# Altium schematic sheet overview.SchDoc
size Letter; SheetNumber: 1; SheetTotal: 8
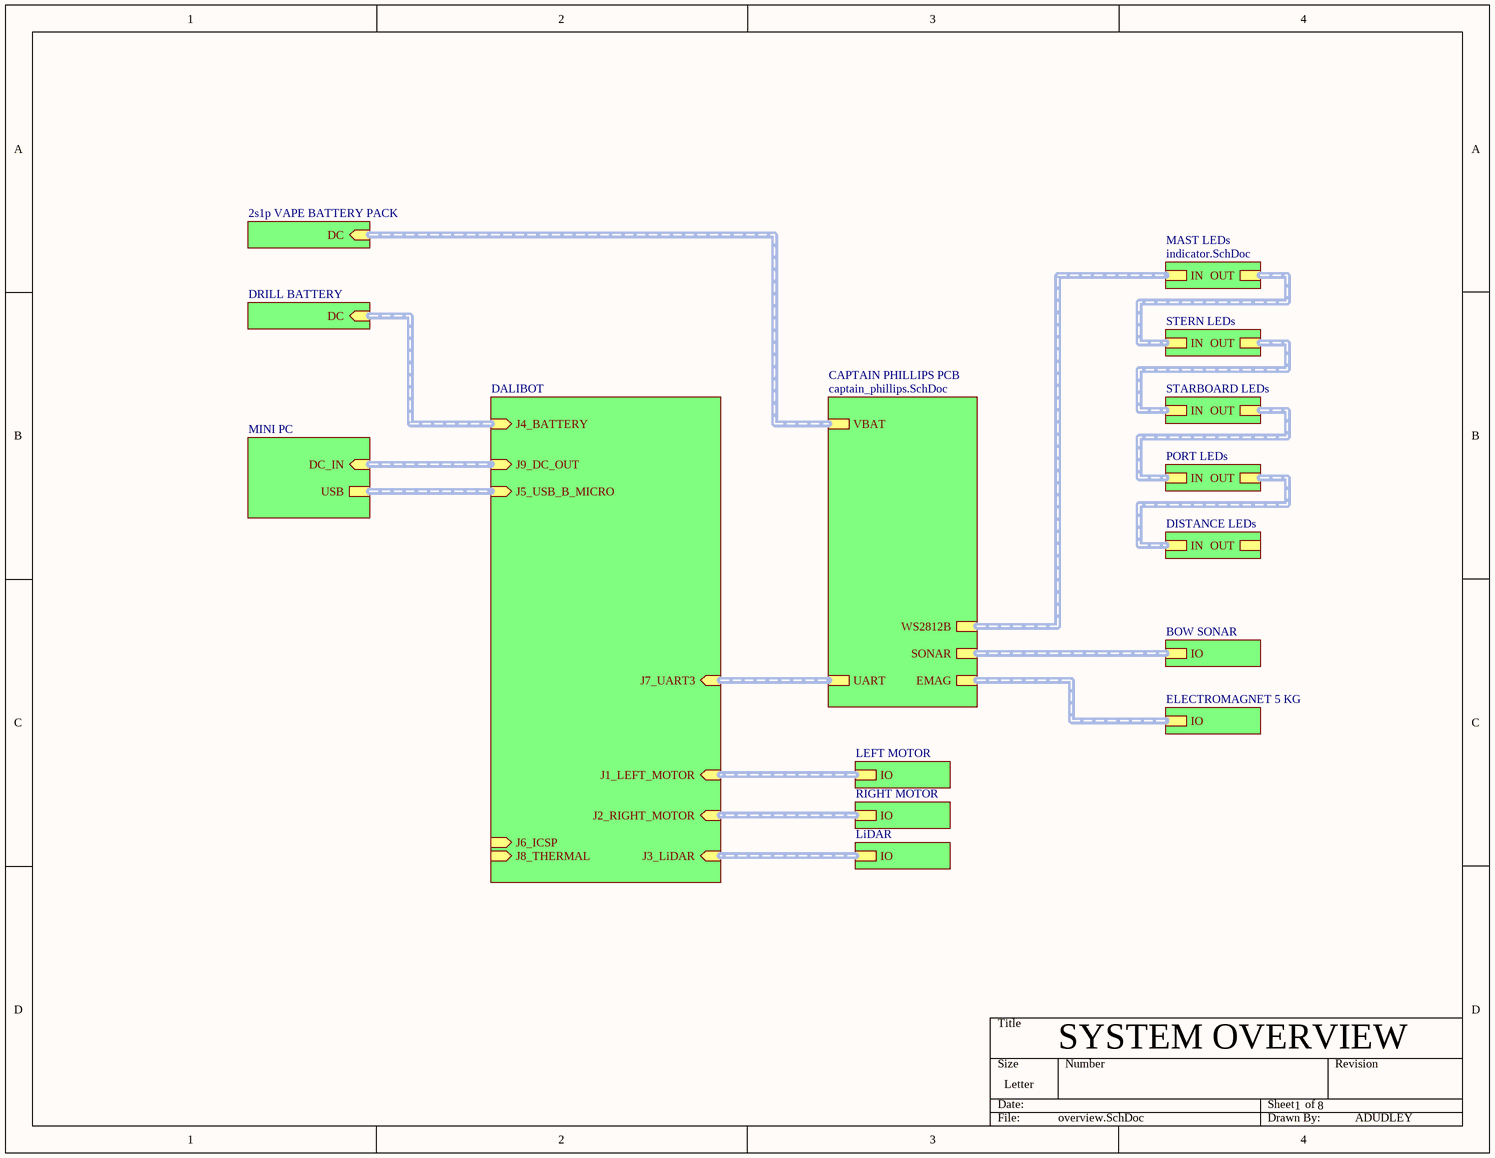
[diagram p0: overview.SchDoc]

## Sub-sheets
2s1p VAPE BATTERY PACK = File Name: DC (in)
BOW SONAR = File Name: IO
CAPTAIN PHILLIPS PCB = captain_phillips.SchDoc: SONAR, UART, WS2812B, EMAG, VBAT
DALIBOT = File Name: J1_LEFT_MOTOR (in), J2_RIGHT_MOTOR (in), J3_LiDAR (in), J4_BATTERY (in), J5_USB_B_MICRO (in), J6_ICSP (in), J7_UART3 (in), J8_THERMAL (in), J9_DC_OUT (in)
DISTANCE LEDs = indicator.SchDoc: OUT, IN
DRILL BATTERY = File Name: DC (in)
ELECTROMAGNET 5 KG = File Name: IO
LEFT MOTOR = File Name: IO
LiDAR = File Name: IO
MAST LEDs = indicator.SchDoc: IN, OUT
MINI PC = File Name: USB, DC_IN (in)
PORT LEDs = indicator.SchDoc: OUT, IN
RIGHT MOTOR = File Name: IO
STARBOARD LEDs = indicator.SchDoc: OUT, IN
STERN LEDs = indicator.SchDoc: OUT, IN

## Buses and harness runs
harness sheet 2s1p VAPE BATTERY PACK/DC = sheet CAPTAIN PHILLIPS PCB/VBAT
harness sheet BOW SONAR/IO = sheet CAPTAIN PHILLIPS PCB/SONAR
harness sheet CAPTAIN PHILLIPS PCB/EMAG = sheet ELECTROMAGNET 5 KG/IO
harness sheet CAPTAIN PHILLIPS PCB/UART = sheet DALIBOT/J7_UART3
harness sheet CAPTAIN PHILLIPS PCB/WS2812B = sheet MAST LEDs/IN
harness sheet DALIBOT/J1_LEFT_MOTOR = sheet LEFT MOTOR/IO
harness sheet DALIBOT/J2_RIGHT_MOTOR = sheet RIGHT MOTOR/IO
harness sheet DALIBOT/J3_LiDAR = sheet LiDAR/IO
harness sheet DALIBOT/J4_BATTERY = sheet DRILL BATTERY/DC
harness sheet DALIBOT/J5_USB_B_MICRO = sheet MINI PC/USB
harness sheet DALIBOT/J9_DC_OUT = sheet MINI PC/DC_IN
harness sheet DISTANCE LEDs/IN = sheet PORT LEDs/OUT
harness sheet MAST LEDs/OUT = sheet STERN LEDs/IN
harness sheet PORT LEDs/IN = sheet STARBOARD LEDs/OUT
harness sheet STARBOARD LEDs/IN = sheet STERN LEDs/OUT

## Notes on the sheet
- SYSTEM OVERVIEW
- ADUDLEY